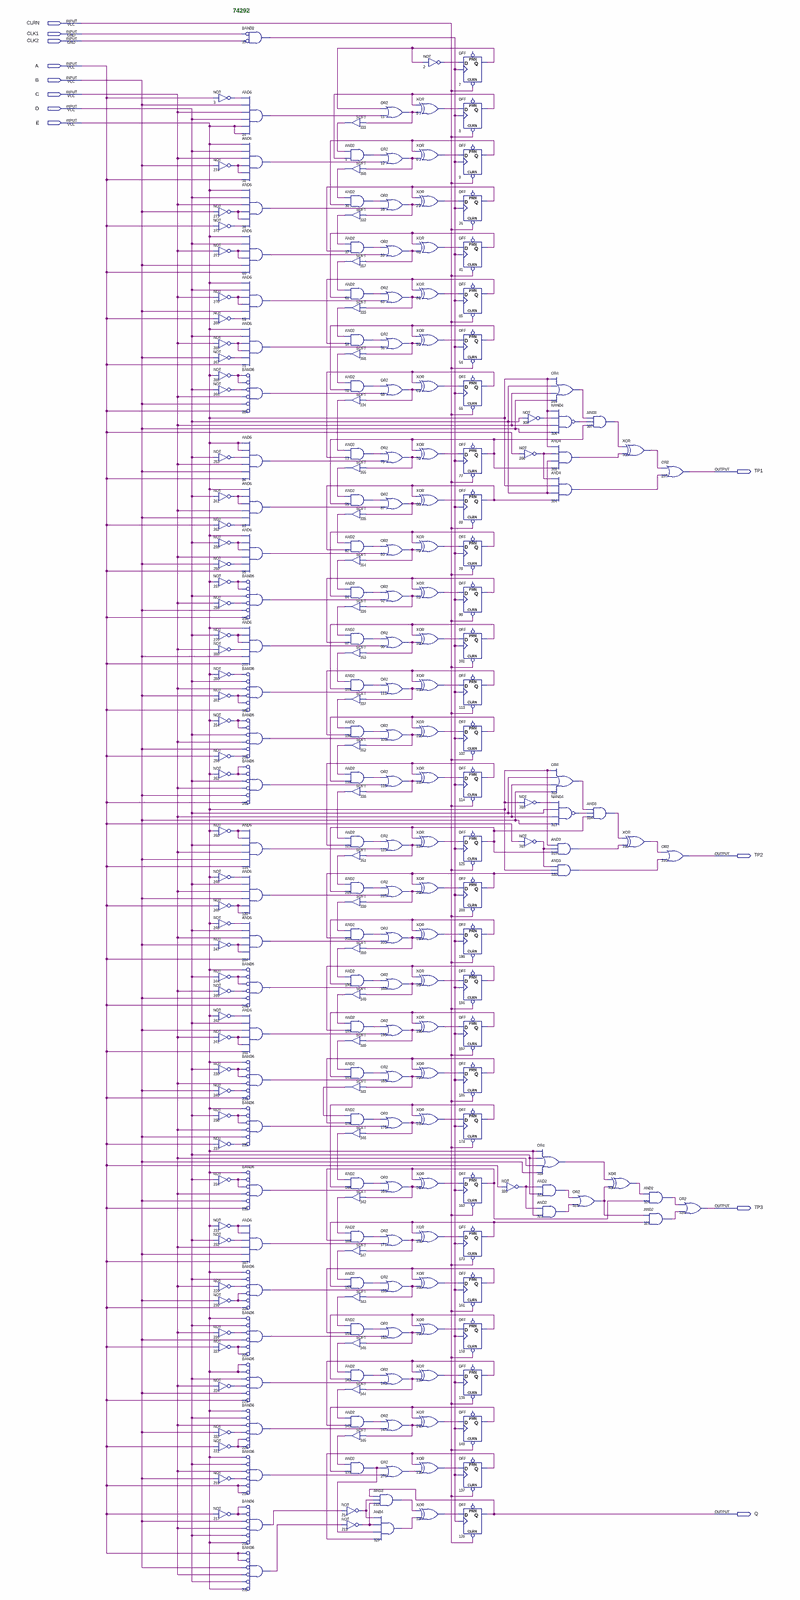
[diagram p0: schematic sheet, whole]
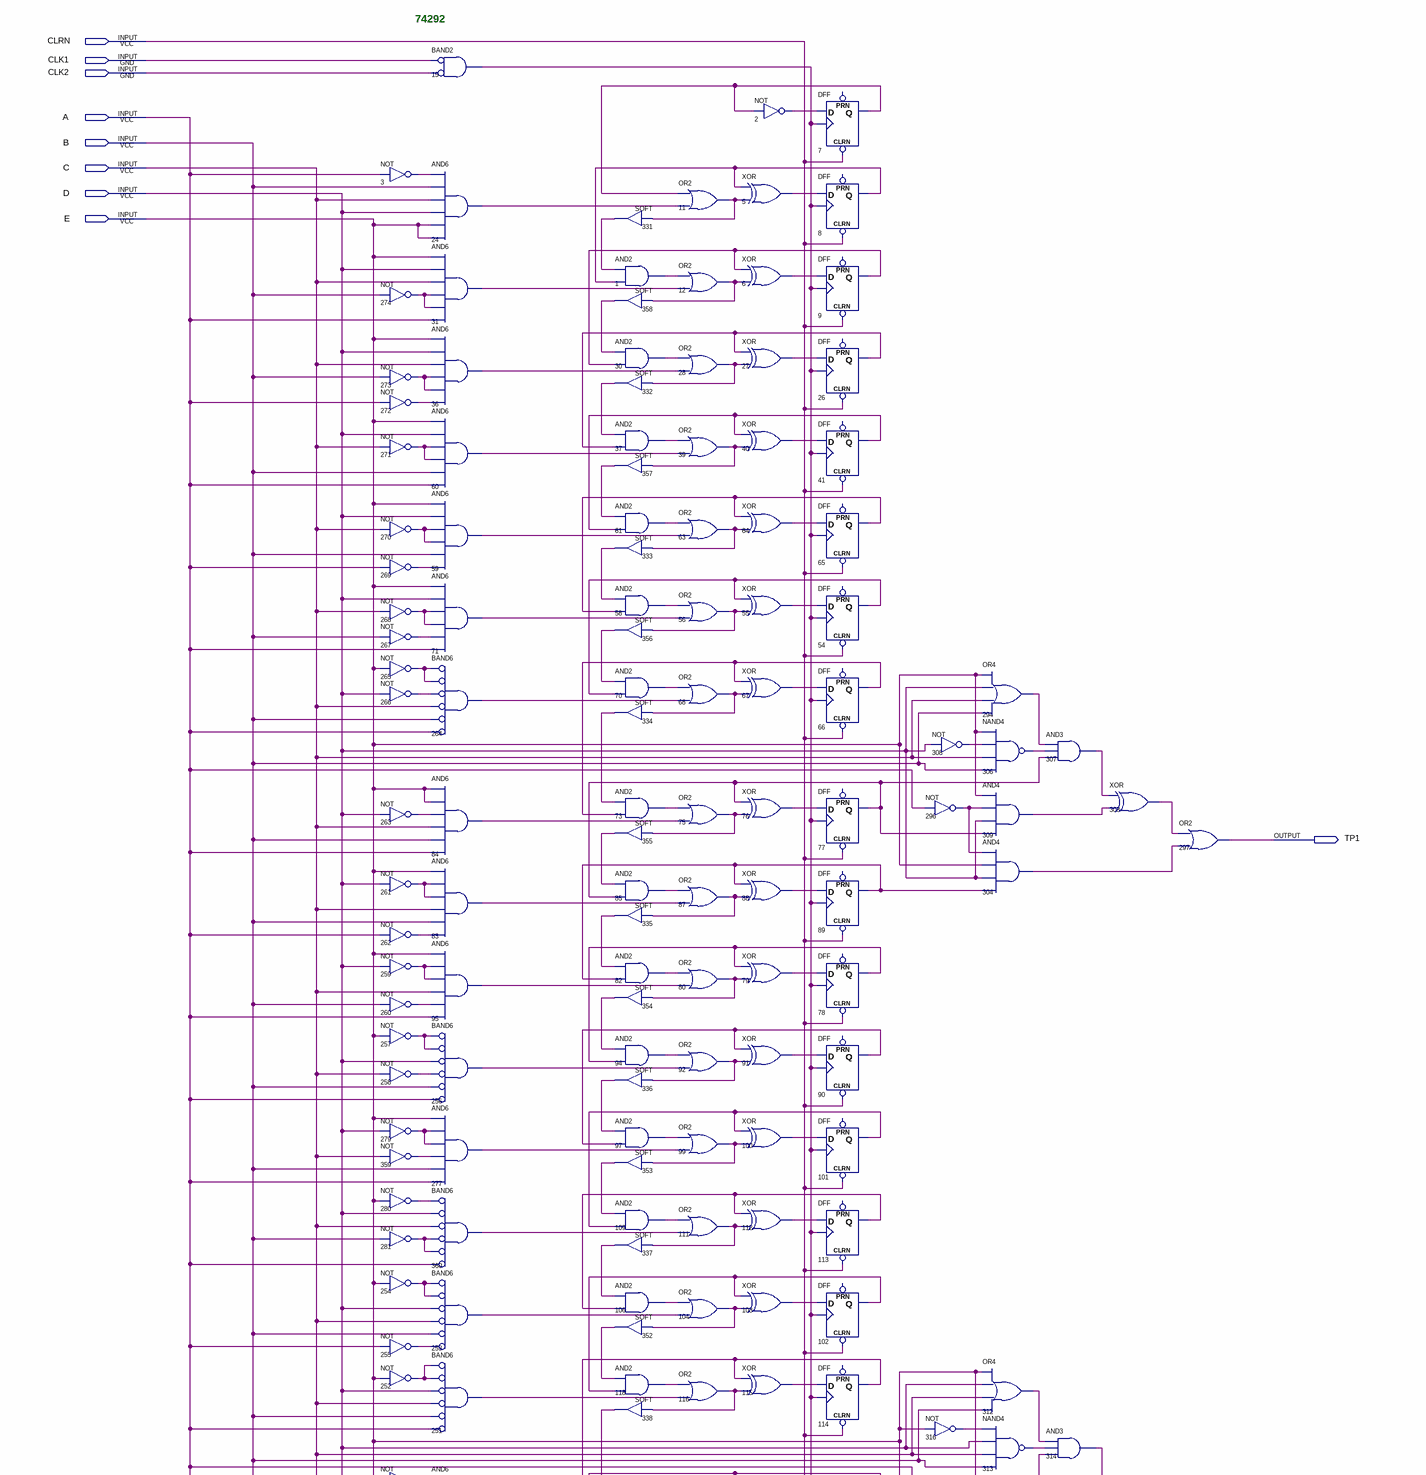
[diagram p1: schematic sheet, upper part]
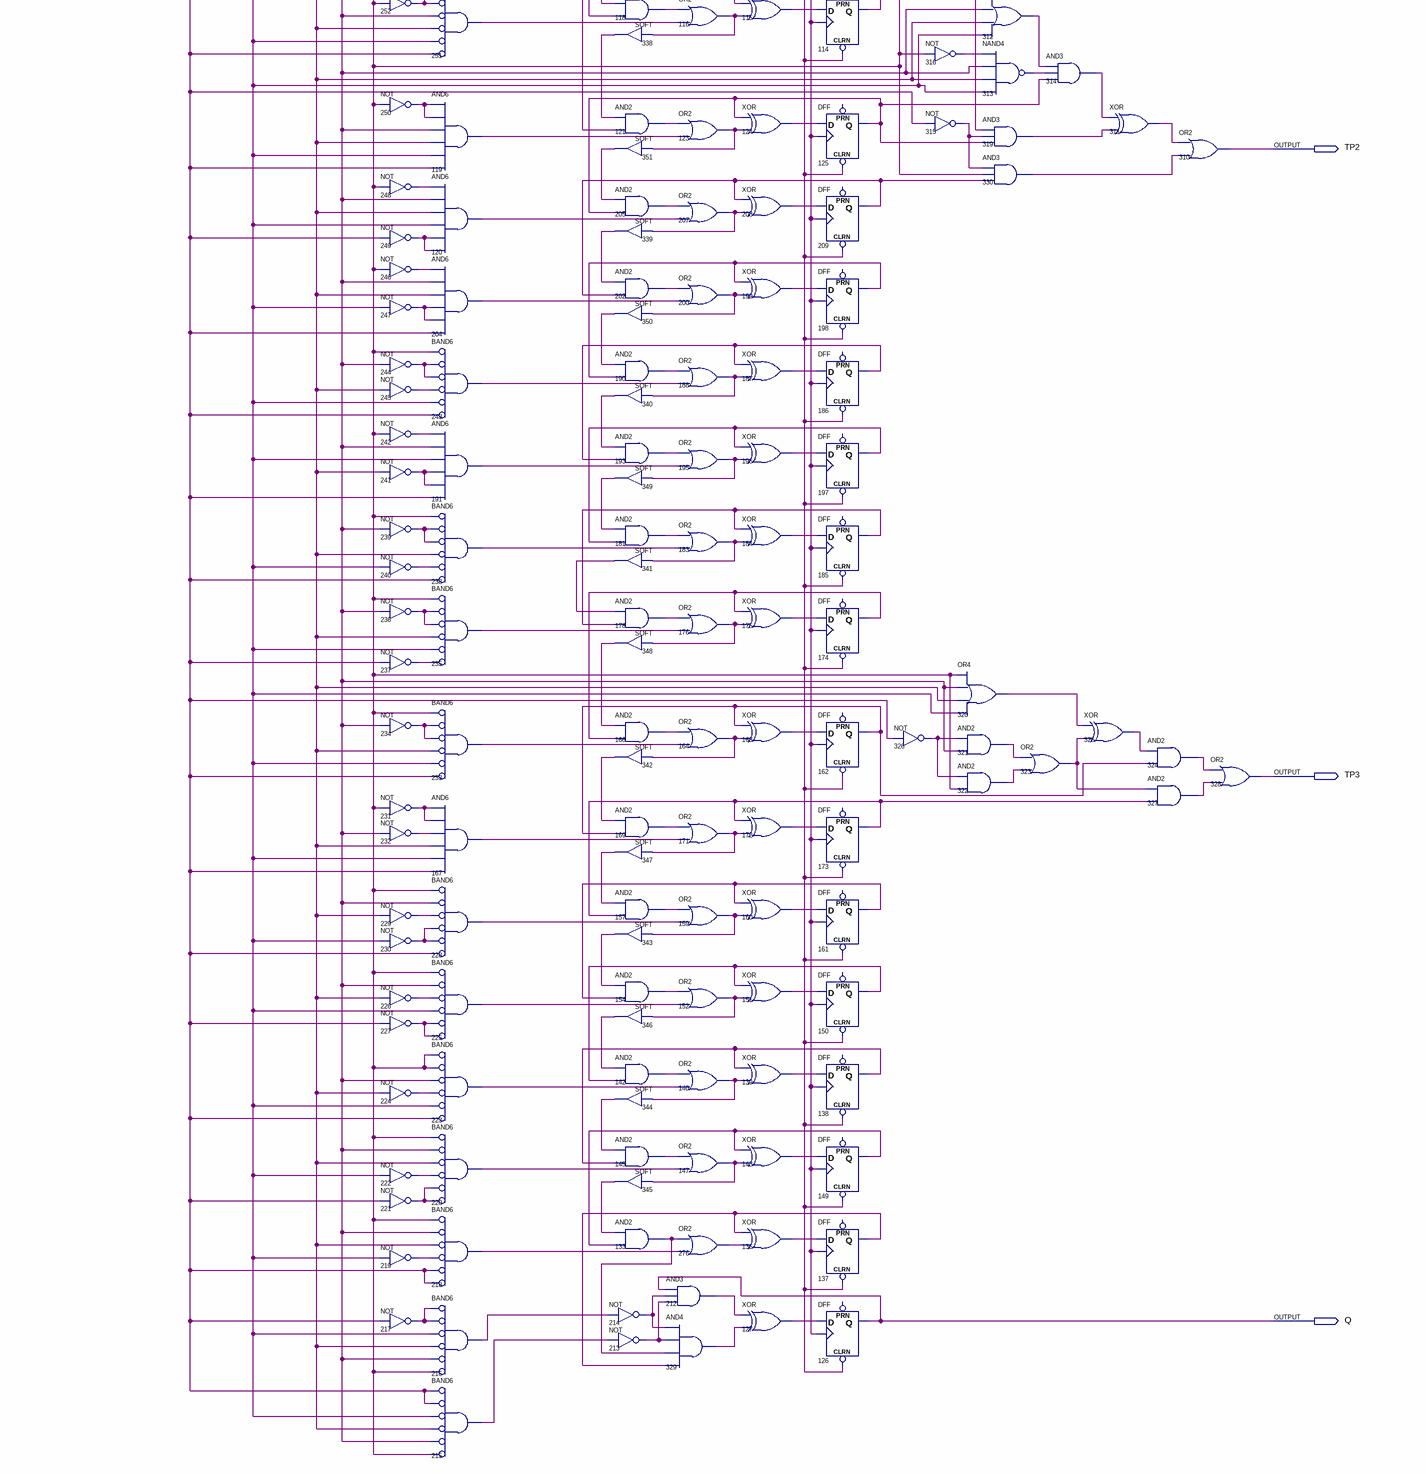
[diagram p2: schematic sheet, lower part]
// Quartus schematic 74292.bdf as structural Verilog: 260 symbols, 12 pins
module \74292  (
  input  CLRN,
  input  CLK1,
  input  CLK2,
  input  A,
  input  B,
  input  C,
  input  D,
  input  E,
  output TP1,
  output TP2,
  output TP3,
  output Q
);

  wire n1_out, n2_out, n3_out, n5_out, n6_out, n7_q, n8_q, n9_q, n11_out, n12_out, n15_out, n24_out, n26_q,
       n27_out, n28_out, n30_out, n31_out, n36_out, n37_out, n39_out, n40_out, n41_q, n54_q, n55_out,
       n56_out, n58_out, n59_out, n60_out, n61_out, n63_out, n64_out, n65_q, n66_q, n67_out, n68_out,
       n70_out, n71_out, n73_out, n75_out, n76_out, n77_q, n78_q, n79_out, n80_out, n82_out, n83_out,
       n84_out, n85_out, n87_out, n88_out, n89_q, n90_q, n91_out, n92_out, n94_out, n95_out, n97_out,
       n99_out, n100_out, n101_q, n102_q, n103_out, n104_out, n106_out, n109_out, n111_out, n112_out, n113_q,
       n114_q, n115_out, n116_out, n118_out, n119_out, n120_out, n121_out, n123_out, n124_out, n125_q,
       n127_out, n133_out, n136_out, n137_q, n138_q, n139_out, n140_out, n142_out, n145_out, n147_out,
       n148_out, n149_q, n150_q, n151_out, n152_out, n154_out, n157_out, n159_out, n160_out, n161_q, n162_q,
       n163_out, n164_out, n166_out, n167_out, n169_out, n171_out, n172_out, n173_q, n174_q, n175_out,
       n176_out, n178_out, n181_out, n183_out, n184_out, n185_q, n186_q, n187_out, n188_out, n190_out,
       n191_out, n193_out, n195_out, n196_out, n197_q, n198_q, n199_out, n200_out, n202_out, n204_out,
       n205_out, n207_out, n208_out, n209_q, n212_out, n213_out, n214_out, n215_out, n216_out, n217_out,
       n218_out, n219_out, n220_out, n221_out, n222_out, n223_out, n224_out, n225_out, n226_out, n227_out,
       n228_out, n229_out, n230_out, n231_out, n232_out, n233_out, n234_out, n235_out, n236_out, n237_out,
       n238_out, n239_out, n240_out, n241_out, n242_out, n243_out, n244_out, n245_out, n246_out, n247_out,
       n248_out, n249_out, n250_out, n251_out, n252_out, n253_out, n254_out, n255_out, n256_out, n257_out,
       n258_out, n259_out, n260_out, n261_out, n262_out, n263_out, n264_out, n265_out, n266_out, n267_out,
       n268_out, n269_out, n270_out, n271_out, n272_out, n273_out, n274_out, n276_out, n277_out, n279_out,
       n280_out, n281_out, n294_out, n296_out, n303_out, n304_out, n306_out, n307_out, n308_out, n309_out,
       n311_out, n312_out, n313_out, n314_out, n315_out, n316_out, n319_out, n320_out, n321_out, n322_out,
       n323_out, n324_out, n325_out, n326_out, n327_out, n329_out, n330_out, n331_out, n332_out, n333_out,
       n334_out, n335_out, n336_out, n337_out, n338_out, n339_out, n340_out, n341_out, n342_out, n343_out,
       n344_out, n345_out, n346_out, n347_out, n348_out, n349_out, n350_out, n351_out, n352_out, n353_out,
       n354_out, n355_out, n356_out, n357_out, n358_out, n359_out, n360_out;

  not u_3 (n3_out, A);
  not u_274 (n274_out, B);
  not u_273 (n273_out, B);
  not u_272 (n272_out, A);
  not u_271 (n271_out, C);
  not u_270 (n270_out, C);
  not u_269 (n269_out, A);
  not u_268 (n268_out, C);
  not u_267 (n267_out, B);
  not u_265 (n265_out, E);
  not u_266 (n266_out, D);
  not u_263 (n263_out, D);
  not u_261 (n261_out, D);
  not u_262 (n262_out, A);
  not u_259 (n259_out, D);
  not u_260 (n260_out, B);
  not u_257 (n257_out, E);
  not u_258 (n258_out, C);
  not u_279 (n279_out, D);
  not u_359 (n359_out, C);
  not u_280 (n280_out, E);
  not u_281 (n281_out, B);
  not u_254 (n254_out, E);
  not u_255 (n255_out, A);
  not u_252 (n252_out, E);
  not u_250 (n250_out, E);
  not u_248 (n248_out, E);
  not u_249 (n249_out, A);
  not u_246 (n246_out, E);
  not u_247 (n247_out, B);
  not u_244 (n244_out, D);
  not u_245 (n245_out, C);
  not u_242 (n242_out, E);
  not u_241 (n241_out, C);
  not u_239 (n239_out, D);
  not u_240 (n240_out, B);
  not u_236 (n236_out, D);
  not u_237 (n237_out, A);
  not u_234 (n234_out, D);
  not u_231 (n231_out, E);
  not u_232 (n232_out, D);
  not u_229 (n229_out, C);
  not u_230 (n230_out, B);
  not u_226 (n226_out, C);
  not u_227 (n227_out, A);
  not u_224 (n224_out, C);
  not u_222 (n222_out, B);
  not u_221 (n221_out, A);
  not u_219 (n219_out, B);
  not u_217 (n217_out, A);
  and u_15 (n15_out, ~CLK1, ~CLK2);  // BAND2
  and u_24 (n24_out, n3_out, B, C, D, E, E);
  and u_31 (n31_out, E, D, C, n274_out, n274_out, A);
  and u_36 (n36_out, E, D, C, n273_out, n273_out, n272_out);
  and u_60 (n60_out, E, D, n271_out, n271_out, B, A);
  and u_59 (n59_out, E, D, n270_out, n270_out, B, n269_out);
  and u_71 (n71_out, E, D, n268_out, n268_out, n267_out, A);
  and u_264 (n264_out, ~n265_out, ~n265_out, ~n266_out, ~C, ~B, ~A);  // BAND6
  and u_84 (n84_out, E, E, n263_out, C, B, A);
  and u_83 (n83_out, E, n261_out, n261_out, C, B, n262_out);
  and u_95 (n95_out, E, n259_out, n259_out, C, n260_out, A);
  and u_256 (n256_out, ~n257_out, ~n257_out, ~D, ~n258_out, ~B, ~A);  // BAND6
  and u_277 (n277_out, E, n279_out, n279_out, n359_out, B, A);
  and u_360 (n360_out, ~n280_out, ~D, ~C, ~n281_out, ~n281_out, ~A);  // BAND6
  and u_253 (n253_out, ~n254_out, ~n254_out, ~D, ~C, ~B, ~n255_out);  // BAND6
  and u_251 (n251_out, ~n252_out, ~n252_out, ~D, ~C, ~B, ~A);  // BAND6
  and u_119 (n119_out, n250_out, n250_out, D, C, B, A);
  and u_120 (n120_out, n248_out, D, C, B, n249_out, n249_out);
  and u_204 (n204_out, n246_out, D, C, n247_out, n247_out, A);
  and u_243 (n243_out, ~E, ~n244_out, ~n244_out, ~n245_out, ~B, ~A);  // BAND6
  and u_191 (n191_out, n242_out, D, B, n241_out, n241_out, A);
  and u_238 (n238_out, ~E, ~n239_out, ~n239_out, ~C, ~n240_out, ~A);  // BAND6
  and u_235 (n235_out, ~E, ~n236_out, ~n236_out, ~C, ~B, ~n237_out);  // BAND6
  and u_233 (n233_out, ~E, ~n234_out, ~n234_out, ~C, ~B, ~A);  // BAND6
  and u_167 (n167_out, n231_out, n231_out, n232_out, C, B, A);
  and u_228 (n228_out, ~E, ~D, ~n229_out, ~n230_out, ~n230_out, ~A);  // BAND6
  and u_225 (n225_out, ~E, ~D, ~n226_out, ~B, ~n227_out, ~n227_out);  // BAND6
  and u_223 (n223_out, ~E, ~E, ~D, ~n224_out, ~B, ~A);  // BAND6
  and u_220 (n220_out, ~E, ~D, ~C, ~n222_out, ~n221_out, ~n221_out);  // BAND6
  and u_218 (n218_out, ~E, ~D, ~C, ~n219_out, ~A, ~A);  // BAND6
  and u_216 (n216_out, ~n217_out, ~n217_out, ~B, ~C, ~D, ~E);  // BAND6
  and u_215 (n215_out, ~A, ~A, ~B, ~C, ~D, ~E);  // BAND6
  SOFT u_331 (.IN(n11_out), .OUT(n331_out));
  and u_1 (n1_out, n331_out, n8_q);
  SOFT u_358 (.IN(n12_out), .OUT(n358_out));
  and u_30 (n30_out, n358_out, n9_q);
  SOFT u_332 (.IN(n28_out), .OUT(n332_out));
  and u_37 (n37_out, n332_out, n26_q);
  SOFT u_357 (.IN(n39_out), .OUT(n357_out));
  and u_61 (n61_out, n357_out, n41_q);
  SOFT u_333 (.IN(n63_out), .OUT(n333_out));
  and u_58 (n58_out, n333_out, n65_q);
  SOFT u_356 (.IN(n56_out), .OUT(n356_out));
  and u_70 (n70_out, n356_out, n54_q);
  SOFT u_334 (.IN(n68_out), .OUT(n334_out));
  and u_73 (n73_out, n334_out, n66_q);
  SOFT u_355 (.IN(n75_out), .OUT(n355_out));
  and u_85 (n85_out, n355_out, n77_q);
  SOFT u_335 (.IN(n87_out), .OUT(n335_out));
  and u_82 (n82_out, n335_out, n89_q);
  SOFT u_354 (.IN(n80_out), .OUT(n354_out));
  and u_94 (n94_out, n354_out, n78_q);
  SOFT u_336 (.IN(n92_out), .OUT(n336_out));
  and u_97 (n97_out, n336_out, n90_q);
  SOFT u_353 (.IN(n99_out), .OUT(n353_out));
  and u_109 (n109_out, n353_out, n101_q);
  SOFT u_337 (.IN(n111_out), .OUT(n337_out));
  and u_106 (n106_out, n337_out, n113_q);
  SOFT u_352 (.IN(n104_out), .OUT(n352_out));
  and u_118 (n118_out, n352_out, n102_q);
  SOFT u_338 (.IN(n116_out), .OUT(n338_out));
  and u_121 (n121_out, n338_out, n114_q);
  SOFT u_351 (.IN(n123_out), .OUT(n351_out));
  and u_205 (n205_out, n351_out, n125_q);
  SOFT u_339 (.IN(n207_out), .OUT(n339_out));
  and u_202 (n202_out, n339_out, n209_q);
  SOFT u_350 (.IN(n200_out), .OUT(n350_out));
  and u_190 (n190_out, n350_out, n198_q);
  SOFT u_340 (.IN(n188_out), .OUT(n340_out));
  and u_193 (n193_out, n340_out, n186_q);
  SOFT u_349 (.IN(n195_out), .OUT(n349_out));
  and u_181 (n181_out, n349_out, n197_q);
  SOFT u_341 (.IN(n183_out), .OUT(n341_out));
  and u_178 (n178_out, n341_out, n185_q);
  SOFT u_348 (.IN(n176_out), .OUT(n348_out));
  and u_166 (n166_out, n348_out, n174_q);
  SOFT u_342 (.IN(n164_out), .OUT(n342_out));
  and u_169 (n169_out, n342_out, n162_q);
  SOFT u_347 (.IN(n171_out), .OUT(n347_out));
  and u_157 (n157_out, n347_out, n173_q);
  SOFT u_343 (.IN(n159_out), .OUT(n343_out));
  and u_154 (n154_out, n343_out, n161_q);
  SOFT u_346 (.IN(n152_out), .OUT(n346_out));
  and u_142 (n142_out, n346_out, n150_q);
  SOFT u_344 (.IN(n140_out), .OUT(n344_out));
  and u_145 (n145_out, n344_out, n138_q);
  SOFT u_345 (.IN(n147_out), .OUT(n345_out));
  and u_133 (n133_out, n345_out, n149_q);
  not u_214 (n214_out, n216_out);
  not u_213 (n213_out, n215_out);
  or u_11 (n11_out, n7_q, n24_out);
  or u_12 (n12_out, n1_out, n31_out);
  or u_28 (n28_out, n30_out, n36_out);
  or u_39 (n39_out, n37_out, n60_out);
  or u_63 (n63_out, n61_out, n59_out);
  or u_56 (n56_out, n58_out, n71_out);
  or u_68 (n68_out, n70_out, n264_out);
  or u_75 (n75_out, n73_out, n84_out);
  or u_87 (n87_out, n85_out, n83_out);
  or u_80 (n80_out, n82_out, n95_out);
  or u_92 (n92_out, n94_out, n256_out);
  or u_99 (n99_out, n97_out, n277_out);
  or u_111 (n111_out, n109_out, n360_out);
  or u_104 (n104_out, n106_out, n253_out);
  or u_116 (n116_out, n118_out, n251_out);
  or u_123 (n123_out, n121_out, n119_out);
  or u_207 (n207_out, n205_out, n120_out);
  or u_200 (n200_out, n202_out, n204_out);
  or u_188 (n188_out, n190_out, n243_out);
  or u_195 (n195_out, n193_out, n191_out);
  or u_183 (n183_out, n181_out, n238_out);
  or u_176 (n176_out, n178_out, n235_out);
  or u_164 (n164_out, n166_out, n233_out);
  or u_171 (n171_out, n169_out, n167_out);
  or u_159 (n159_out, n157_out, n228_out);
  or u_152 (n152_out, n154_out, n225_out);
  or u_140 (n140_out, n142_out, n223_out);
  or u_147 (n147_out, n145_out, n220_out);
  or u_276 (n276_out, n133_out, n218_out);
  and u_212 (n212_out, Q, n214_out, n213_out);
  and u_329 (n329_out, n214_out, n213_out, n133_out, n137_q);
  not u_2 (n2_out, n7_q);
  xor u_5 (n5_out, n8_q, n11_out);
  xor u_6 (n6_out, n9_q, n12_out);
  xor u_27 (n27_out, n26_q, n28_out);
  xor u_40 (n40_out, n41_q, n39_out);
  xor u_64 (n64_out, n65_q, n63_out);
  xor u_55 (n55_out, n54_q, n56_out);
  xor u_67 (n67_out, n66_q, n68_out);
  xor u_76 (n76_out, n77_q, n75_out);
  xor u_88 (n88_out, n89_q, n87_out);
  xor u_79 (n79_out, n78_q, n80_out);
  xor u_91 (n91_out, n90_q, n92_out);
  xor u_100 (n100_out, n101_q, n99_out);
  xor u_112 (n112_out, n113_q, n111_out);
  xor u_103 (n103_out, n102_q, n104_out);
  xor u_115 (n115_out, n114_q, n116_out);
  xor u_124 (n124_out, n125_q, n123_out);
  xor u_208 (n208_out, n209_q, n207_out);
  xor u_199 (n199_out, n198_q, n200_out);
  xor u_187 (n187_out, n186_q, n188_out);
  xor u_196 (n196_out, n197_q, n195_out);
  xor u_184 (n184_out, n185_q, n183_out);
  xor u_175 (n175_out, n174_q, n176_out);
  xor u_163 (n163_out, n162_q, n164_out);
  xor u_172 (n172_out, n173_q, n171_out);
  xor u_160 (n160_out, n161_q, n159_out);
  xor u_151 (n151_out, n150_q, n152_out);
  xor u_139 (n139_out, n138_q, n140_out);
  xor u_148 (n148_out, n149_q, n147_out);
  xor u_136 (n136_out, n137_q, n276_out);
  xor u_127 (n127_out, n212_out, n329_out);
  DFF u_7 (.CLRN(CLRN), .CLK(n15_out), .D(n2_out), .Q(n7_q));  // open: PRN
  DFF u_8 (.CLRN(CLRN), .CLK(n15_out), .D(n5_out), .Q(n8_q));  // open: PRN
  DFF u_9 (.CLRN(CLRN), .CLK(n15_out), .D(n6_out), .Q(n9_q));  // open: PRN
  DFF u_26 (.CLRN(CLRN), .CLK(n15_out), .D(n27_out), .Q(n26_q));  // open: PRN
  DFF u_41 (.CLRN(CLRN), .CLK(n15_out), .D(n40_out), .Q(n41_q));  // open: PRN
  DFF u_65 (.CLRN(CLRN), .CLK(n15_out), .D(n64_out), .Q(n65_q));  // open: PRN
  DFF u_54 (.CLRN(CLRN), .CLK(n15_out), .D(n55_out), .Q(n54_q));  // open: PRN
  DFF u_66 (.CLRN(CLRN), .CLK(n15_out), .D(n67_out), .Q(n66_q));  // open: PRN
  DFF u_77 (.CLRN(CLRN), .CLK(n15_out), .D(n76_out), .Q(n77_q));  // open: PRN
  DFF u_89 (.CLRN(CLRN), .CLK(n15_out), .D(n88_out), .Q(n89_q));  // open: PRN
  DFF u_78 (.CLRN(CLRN), .CLK(n15_out), .D(n79_out), .Q(n78_q));  // open: PRN
  DFF u_90 (.CLRN(CLRN), .CLK(n15_out), .D(n91_out), .Q(n90_q));  // open: PRN
  DFF u_101 (.CLRN(CLRN), .CLK(n15_out), .D(n100_out), .Q(n101_q));  // open: PRN
  DFF u_113 (.CLRN(CLRN), .CLK(n15_out), .D(n112_out), .Q(n113_q));  // open: PRN
  DFF u_102 (.CLRN(CLRN), .CLK(n15_out), .D(n103_out), .Q(n102_q));  // open: PRN
  DFF u_114 (.CLRN(CLRN), .CLK(n15_out), .D(n115_out), .Q(n114_q));  // open: PRN
  DFF u_125 (.CLRN(CLRN), .CLK(n15_out), .D(n124_out), .Q(n125_q));  // open: PRN
  DFF u_209 (.CLRN(CLRN), .CLK(n15_out), .D(n208_out), .Q(n209_q));  // open: PRN
  DFF u_198 (.CLRN(CLRN), .CLK(n15_out), .D(n199_out), .Q(n198_q));  // open: PRN
  DFF u_186 (.CLRN(CLRN), .CLK(n15_out), .D(n187_out), .Q(n186_q));  // open: PRN
  DFF u_197 (.CLRN(CLRN), .CLK(n15_out), .D(n196_out), .Q(n197_q));  // open: PRN
  DFF u_185 (.CLRN(CLRN), .CLK(n15_out), .D(n184_out), .Q(n185_q));  // open: PRN
  DFF u_174 (.CLRN(CLRN), .CLK(n15_out), .D(n175_out), .Q(n174_q));  // open: PRN
  DFF u_162 (.CLRN(CLRN), .CLK(n15_out), .D(n163_out), .Q(n162_q));  // open: PRN
  DFF u_173 (.CLRN(CLRN), .CLK(n15_out), .D(n172_out), .Q(n173_q));  // open: PRN
  DFF u_161 (.CLRN(CLRN), .CLK(n15_out), .D(n160_out), .Q(n161_q));  // open: PRN
  DFF u_150 (.CLRN(CLRN), .CLK(n15_out), .D(n151_out), .Q(n150_q));  // open: PRN
  DFF u_138 (.CLRN(CLRN), .CLK(n15_out), .D(n139_out), .Q(n138_q));  // open: PRN
  DFF u_149 (.CLRN(CLRN), .CLK(n15_out), .D(n148_out), .Q(n149_q));  // open: PRN
  DFF u_137 (.CLRN(CLRN), .CLK(n15_out), .D(n136_out), .Q(n137_q));  // open: PRN
  DFF u_126 (.CLRN(CLRN), .CLK(n15_out), .D(n127_out), .Q(Q));  // open: PRN
  not u_308 (n308_out, D);
  not u_296 (n296_out, A);
  not u_316 (n316_out, E);
  not u_315 (n315_out, A);
  not u_326 (n326_out, A);
  or u_294 (n294_out, E, D, C, B);
  nand u_306 (n306_out, E, n308_out, C, B);
  and u_309 (n309_out, E, n296_out, D, n77_q);
  and u_304 (n304_out, n296_out, E, D, n89_q);
  or u_312 (n312_out, E, D, C, B);
  nand u_313 (n313_out, n316_out, D, C, B);
  and u_319 (n319_out, E, n315_out, n125_q);
  and u_330 (n330_out, n315_out, E, n209_q);
  or u_320 (n320_out, E, D, C, B);
  and u_321 (n321_out, n326_out, D);
  and u_322 (n322_out, n326_out, E);
  or u_323 (n323_out, n321_out, n322_out);
  and u_307 (n307_out, n294_out, n306_out, n77_q);
  and u_314 (n314_out, n312_out, n313_out, n125_q);
  xor u_325 (n325_out, n320_out, n323_out);
  xor u_303 (n303_out, n307_out, n309_out);
  xor u_311 (n311_out, n314_out, n319_out);
  or u_297 (TP1, n303_out, n304_out);
  or u_310 (TP2, n311_out, n330_out);
  and u_324 (n324_out, n325_out, n162_q);
  and u_327 (n327_out, n323_out, n173_q);
  or u_328 (TP3, n324_out, n327_out);

  // Notes on the sheet:
  //   74292
endmodule
